# EAGLE schematic mainModule (EAGLE 6.3)
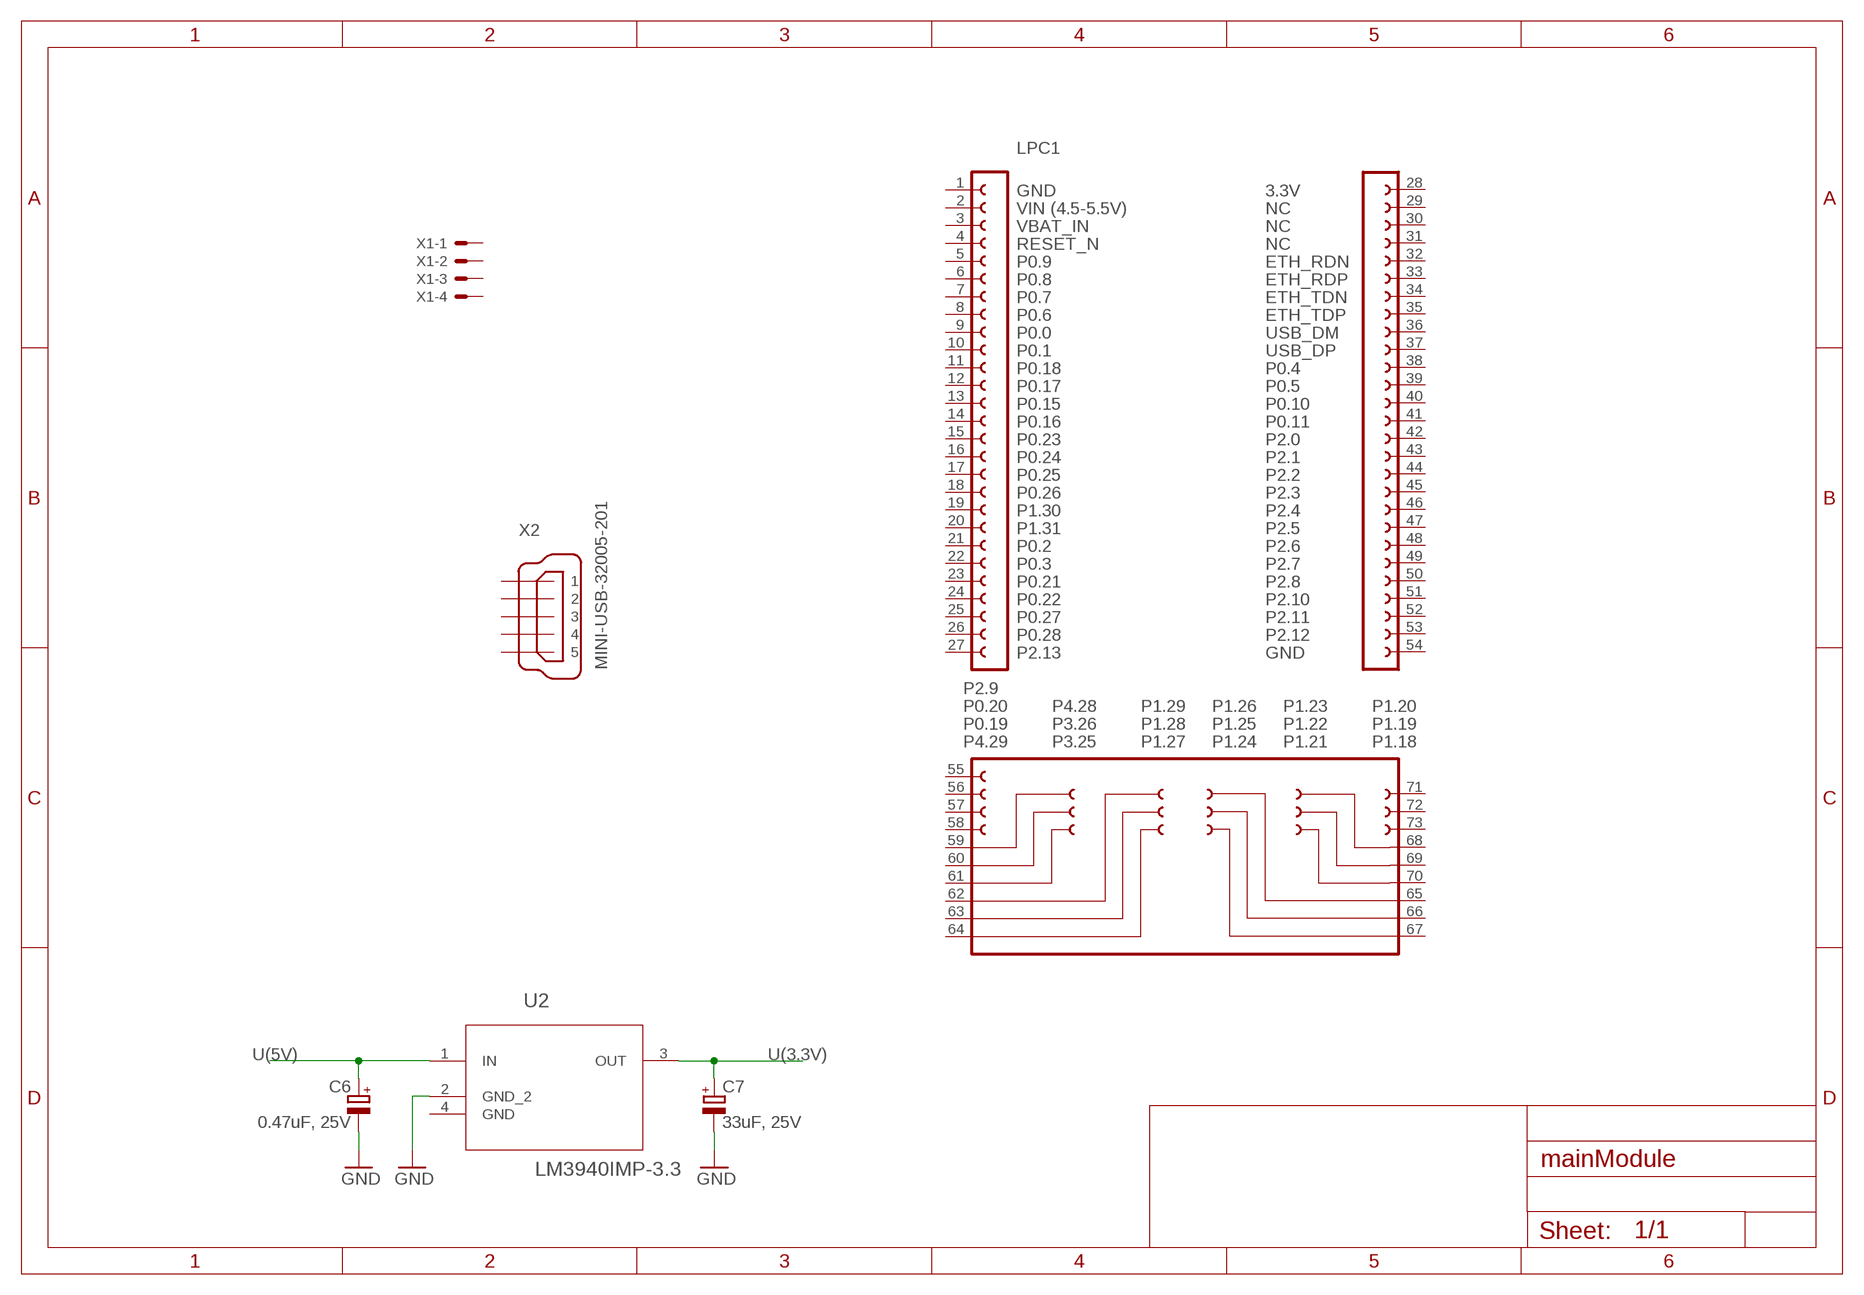
[diagram p0: schematic, sheet 1]

## Parts
C6  0.47uF, 25V  CPOL-EUC  [PANASONIC_C]
C7  33uF, 25V  CPOL-EUC  [PANASONIC_C]
LPC1  LPCXPRESSO_LPC1769  [LPCXPRESSO_LPC1769]
U2  LM3940IMP-3.3  [SOT230P696X180-4N]
X1  KK-156-4  [KK-156-4]
X2  MINI-USB-32005-201  [32005-201]

## Nets
GND: C6.- C7.- U2.2(GND_2)
U(3.3V): C7.+ U2.3(OUT)
U(5V): C6.+ U2.1(IN)
Unconnected: LPC1.1 LPC1.2 LPC1.3 LPC1.4 LPC1.5 LPC1.6 LPC1.7 LPC1.8 LPC1.9 LPC1.10 LPC1.11 LPC1.12 LPC1.13 LPC1.14 LPC1.15 LPC1.16 LPC1.17 LPC1.18 LPC1.19 LPC1.20 LPC1.21 LPC1.22 LPC1.23 LPC1.24 LPC1.25 LPC1.26 LPC1.27 LPC1.28 LPC1.29 LPC1.30 LPC1.31 LPC1.32 LPC1.33 LPC1.34 LPC1.35 LPC1.36 LPC1.37 LPC1.38 LPC1.39 LPC1.40 LPC1.41 LPC1.42 LPC1.43 LPC1.44 LPC1.45 LPC1.46 LPC1.47 LPC1.48 LPC1.49 LPC1.50 LPC1.51 LPC1.52 LPC1.53 LPC1.54 LPC1.55 LPC1.56 LPC1.57 LPC1.58 LPC1.59 LPC1.60 LPC1.61 LPC1.62 LPC1.63 LPC1.64 LPC1.65 LPC1.66 LPC1.67 LPC1.68 LPC1.69 LPC1.70 LPC1.71 LPC1.72 LPC1.73 U2.4(GND) X1.1 X1.2 X1.3 X1.4 X2.1 X2.2 X2.3 X2.4 X2.5

## Library data of the parts
C6 C7 = resistor:CPOL-EU: POLARIZED CAPACITOR, European symbol
LPC1 = LPCXpresso_LPC1769_board:LPCXPRESSO_LPC1769
U2 = LM3940:LM3940IMP-3.3: Low Dropout Regulator; MPN: LM3940IMP-33; OC_FARNELL: 9779280; OC_NEWARK: 7B6637; PACKAGE: SOT-223-4; SUPPLIER: TEXAS INSTRUMENTS
X1 = con-molex:KK-156-4: KK 156 HEADER Source: http://www.molex.com/pdm_docs/sd/026604100_sd.pdf; OC_FARNELL: unknown; OC_NEWARK: unknown
X2 = con-cypressindustries:MINI-USB-: MINI USB-B Conector Source: www.cypressindustries.com; OC_FARNELL: unknown; OC_NEWARK: unknown